# Altium project SLAVE.PrjPcb
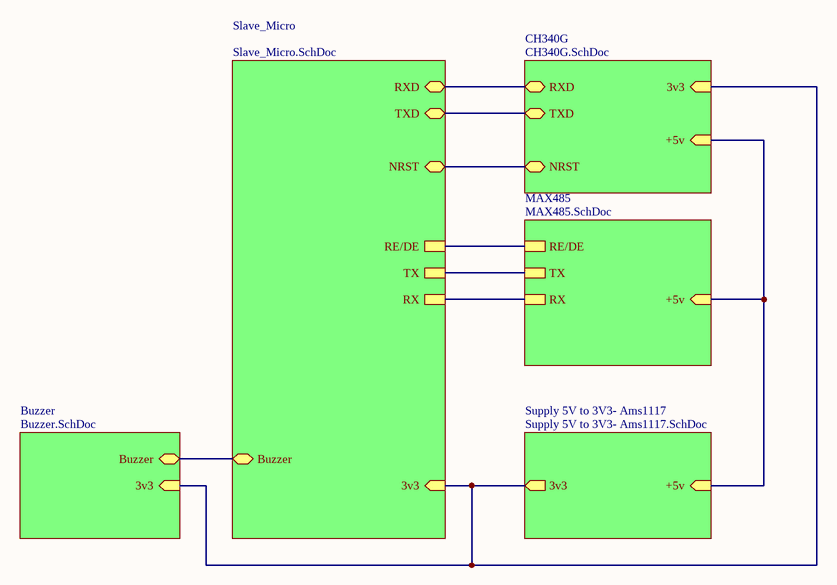
[diagram p0: SLAVE.SchDoc]
5 sheets, 56 parts. Net scope: hierarchical (ports join the sheet entries above them; power ports are global).
Board file: SLAVE.PcbDoc
Sheets:
  SLAVE.SchDoc
    Slave_Micro = Slave_Micro.SchDoc
    Supply 5V to 3V3- Ams1117 = Supply 5V to 3V3- Ams1117.SchDoc
    CH340G = CH340G.SchDoc
    MAX485 = MAX485.SchDoc

## Sheet SLAVE.SchDoc
size A

### Sub-sheets
Buzzer = Buzzer.SchDoc (file not in this document): 3v3 (in), Buzzer (bidir)
CH340G = CH340G.SchDoc: +5v (in), RXD (bidir), TXD (bidir), NRST (bidir), 3v3 (in)
MAX485 = MAX485.SchDoc: +5v (in), RE/DE, TX, RX
Slave_Micro = Slave_Micro.SchDoc: NRST (bidir), 3v3 (in), TX, RX, RE/DE, RXD (bidir), TXD (bidir), Buzzer (bidir)
Supply 5V to 3V3- Ams1117 = Supply 5V to 3V3- Ams1117.SchDoc: +5v (in), 3v3 (out)

### Nets
3v3: sheet Slave_Micro/3v3, sheet Supply 5V to 3V3- Ams1117/3v3, sheet CH340G/3v3, sheet Buzzer/3v3
NRST: sheet Slave_Micro/NRST, sheet CH340G/NRST
NetC3_2: sheet Supply 5V to 3V3- Ams1117/+5v, sheet CH340G/+5v, sheet MAX485/+5v
NetR13_2: sheet Slave_Micro/TXD, sheet CH340G/TXD
NetR65_1: sheet Slave_Micro/RX, sheet MAX485/RX
NetR66_1: sheet Slave_Micro/RE/DE, sheet MAX485/RE/DE
NetR68_1: sheet Slave_Micro/TX, sheet MAX485/TX
NetRX_2: sheet Slave_Micro/RXD, sheet CH340G/RXD
NetU1_25: sheet Slave_Micro/Buzzer, sheet Buzzer/Buzzer

## Sheet Slave_Micro.SchDoc
size A
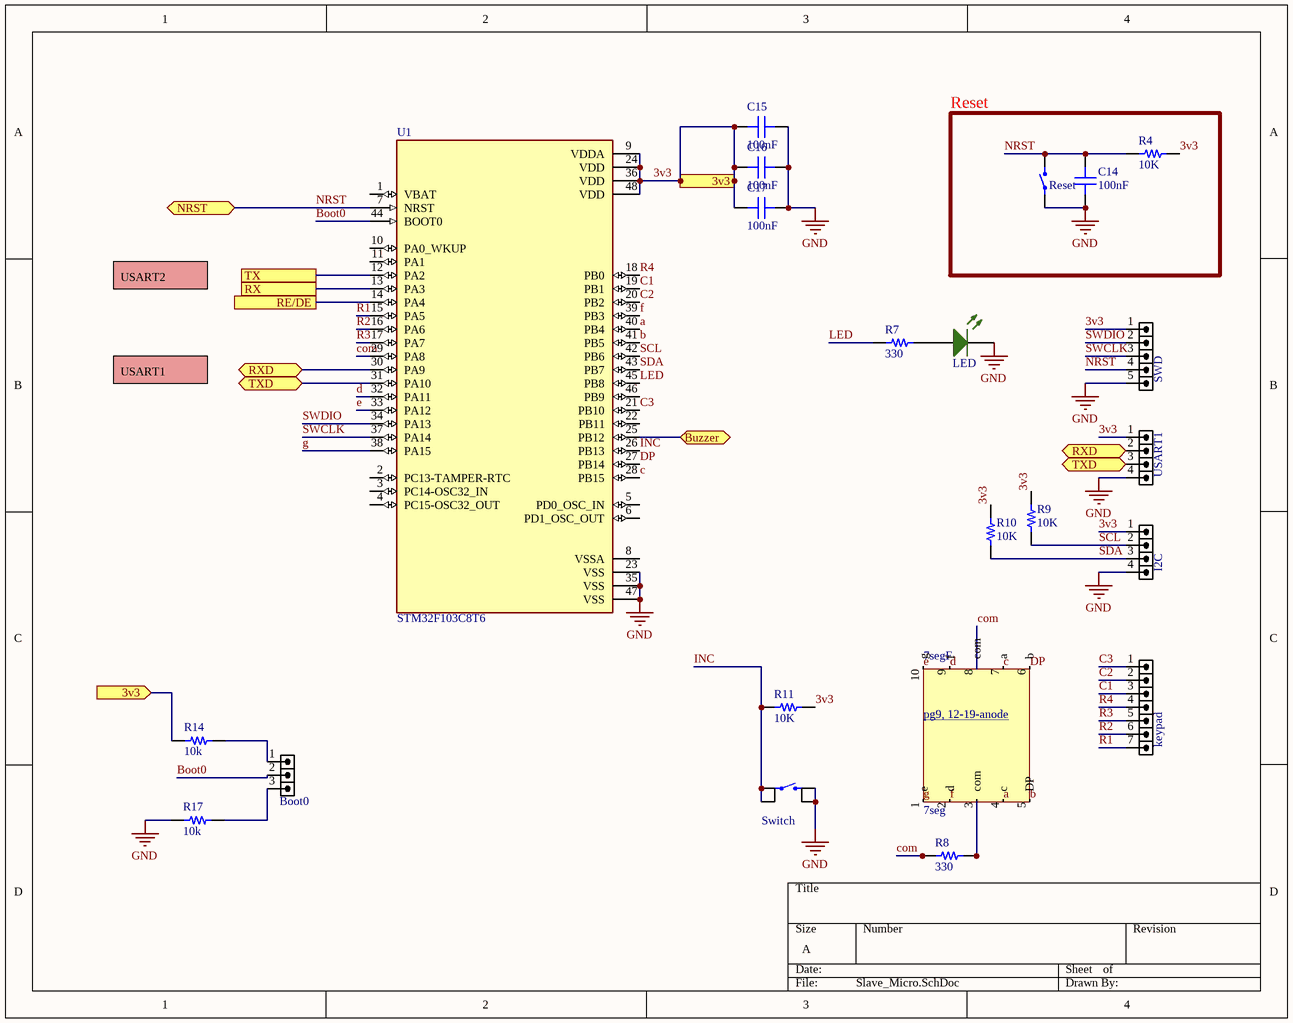
[diagram p1: Slave_Micro.SchDoc]

### Parts
7seg  7seg  [7seg 12x19]  (part F of 6)
Boot0  HDRM3  [HDR_1X3]  (value not drawn)
C14  100nF  [CAP 0805_2012]
C15  100nF  [CAP 0805_2012]
C16  100nF  [CAP 0805_2012]
C17  100nF  [CAP 0805_2012]
I2C  HDR1X4  [HDR_1X4]  (value not drawn)
keypad  HDR1X7  [HDR_1X7]  (value not drawn)
LED  LED SMD 0805 GREEN  [LED_0805_GREEN]  (value not drawn)
R4  10K  [RES 0805_2012]
R7  330  [RES 0805_2012]
R8  330  [RES 0805_2012]
R9  10K  [RES 0805_2012]
R10  10K  [RES 0805_2012]
R11  10K  [RES 0805_2012]
R14  10k  [RES 0805_2012]
R17  10k  [RES 0805_2012]
Reset  Tactile 2PIN 6X3.5mm H4.57mm (SMD)  [SWPBS_SPST_6X3X5]  (value not drawn)
SWD  HDR1X5  [HDR_1X5]  (value not drawn)
Switch  Tactile 4PIN 6X6mm H5mm (THD)  [SWPBT_SPDT_6X6X5SKHH]  (value not drawn)
U1  STM32F103C8T6  [QFP50P900X900X160-48N]
USART1  HDR1X4  [HDR_1X4]  (value not drawn)

### Blocks framed on the sheet
Reset: C14 R4 Reset

### Ports
3v3 (in), Buzzer (bidir), NRST (bidir), RE/DE, RX, RXD (bidir), TX, TXD (bidir)

### Nets
GND: C14.1 C15.1 C16.1 C17.1 I2C.4 LED.2(K) R17.1 Reset.1 SWD.5 Switch.2 Switch.3 U1.23(VSS) U1.35(VSS) U1.47(VSS) USART1.4
3v3: C15.2 C16.2 C17.2 I2C.1 R4.2 R9.2 R10.2 R11.2 R14.1 SWD.1 U1.9(VDDA) U1.24(VDD) U1.36(VDD) U1.48(VDD) USART1.1 ; port 3v3
a: 7seg.4(c) U1.40(PB4)
b: 7seg.5(DP) U1.41(PB5)
Boot0: Boot0.2 U1.44(BOOT0)
c: 7seg.7(a) U1.28(PB15)
C1: keypad.3 U1.19(PB1)
C2: keypad.2 U1.20(PB2)
C3: keypad.1 U1.21(PB10)
com: 7seg.8(com) R8.1 U1.29(PA8)
d: 7seg.9(f) U1.32(PA11)
DP: 7seg.6(b) U1.27(PB14)
e: 7seg.10(g) U1.33(PA12)
f: 7seg.2(d) U1.39(PB3)
g: 7seg.1(e) U1.38(PA15)
INC: R11.1 Switch.1 Switch.4 U1.26(PB13)
LED: R7.1 U1.45(PB8)
NRST: C14.2 R4.1 Reset.2 SWD.4 U1.7(NRST) ; port NRST
R1: keypad.7 U1.15(PA5)
R2: keypad.6 U1.16(PA6)
R3: keypad.5 U1.17(PA7)
R4: keypad.4 U1.18(PB0)
SCL: I2C.2 R9.1 U1.42(PB6)
SDA: I2C.3 R10.1 U1.43(PB7)
SWCLK: SWD.3 U1.37(PA14)
SWDIO: SWD.2 U1.34(PA13)
Net7seg_3: 7seg.3(com) R8.2
NetBoot0_1: Boot0.1 R14.2
NetBoot0_3: Boot0.3 R17.2
NetLED_1: LED.1(A) R7.2
NetR13_2: U1.31(PA10) USART1.3 ; port TXD
NetR65_1: U1.13(PA3) ; port RX
NetR66_1: U1.14(PA4) ; port RE/DE
NetR68_1: U1.12(PA2) ; port TX
NetRX_2: U1.30(PA9) USART1.2 ; port RXD
NetU1_25: U1.25(PB12) ; port Buzzer

Not connected (* = marked no-connect by the designer): U1 1(VBAT) 2(PC13-TAMPER-RTC) 3(PC14-OSC32_IN) 4(PC15-OSC32_OUT) 5(PD0_OSC_IN) 6(PD1_OSC_OUT) 8(VSSA) 10(PA0_WKUP) 11(PA1) 22(PB11) 46(PB9)

### Notes on the sheet
- USART2
- USART1
- (in symbol 7seg, part F) pg9, 12-19-anode

### Library data of the parts
7seg = 7seg: file:///C:/Users/Tamana/Downloads/7SEG-12-19mm-GREEN-ANOD.pdf
Boot0 = HDR_1X3: CONN, HEADER, Male, pitch: 2.54mm, 3POS; VALUE: HDRM3
C14-C17 = Cap 0805: SMT Capacitor; VALUE: 100nF
I2C USART1 = HDR_1X4: CONN, HEADER, Male, pitch: 2.54mm, 4POS; VALUE: HDRM4
keypad = HDR_1X7: CONN, HEADER, Male, pitch: 2.54mm, 7POS; VALUE: HDRM7
R4 R7-R11 R14 R17 = Res 0805: SMT Resistor; VALUE: 1K
Reset = Tactile 2PIN 6X3.5mm H4.57mm (SMD): Tactile Switch SPST-NO Top Actuated Surface Mount; PartNumber: FSMSMTR-ND
SWD = HDR_1X5: CONN, HEADER, Male, pitch: 2.54mm, 5POS; VALUE: HDRM5
Switch = Tactile 4PIN 6X6mm H5mm (THD): Tactile Switch SPST-NO Top Actuated Surface Mount; PartNumber: PTS645SH50SMTR92 LFS
U1 = STM32F103C8T6: ARM® Cortex®-M3 STM32F1 Microcontroller IC 32-Bit 72MHz 64KB (64K x 8) FLASH 48-LQFP (7x7); MF: STMicroelectronics; SnapEDA_Link: https://www.snapeda.com/parts/STM32F103C8T6/STMicroelectronics/view-part/?ref=snap; Package: LQFP-48 STMicroelectronics; Value: *; MP: STM32F103C8T6; Check_prices: https://www.snapeda.com/parts/STM32F103C8T6/STMicroelectronics/view-part/?ref=eda

## Sheet Supply 5V to 3V3- Ams1117.SchDoc
size A
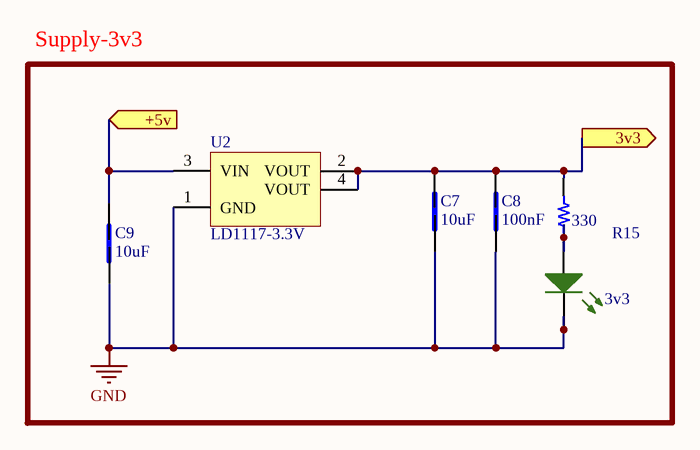
[diagram p2: Supply 5V to 3V3- Ams1117.SchDoc]

### Parts
3v3  LED SMD 0805 GREEN  [LED_0805_GREEN]  (value not drawn)
C7  10uF  [CAP 0805_2012]
C8  100nF  [CAP 0805_2012]
C9  10uF  [CAP 0805_2012]
R15  330  [RES 0805_2012]
U2  LD1117-3.3V  [SOT-223-4 6.5X7MM P2.3MM]

### Blocks framed on the sheet
Supply-3v3: 3v3 C7-C9 R15 U2

### Ports
3v3 (out), +5v (in)

### Nets
GND: 3v3.2(K) C7.1 C8.1 C9.1 U2.1(GND)
3v3: C7.2 C8.2 R15.1 U2.2(VOUT) U2.4(VOUT) ; port 3v3
Net3v3_1: 3v3.1(A) R15.2
NetC3_2: C9.2 U2.3(VIN) ; port +5v

### Library data of the parts
C7-C9 = LD051C182KAB2A: COMMERCIAL CHIP STD JAPAN BULK - FN TAPE/REEL, 7 INCH PAPER TAPE-0805; Package: None; Price: None; Value: *; MP: LD051C182KAB2A; Availability: Unavailable
R15 = Res 0805: SMT Resistor; VALUE: 1K
U2 = LD1117-3.3V (SMD SOT-223): Linear Voltage Regulator IC  1 Output  800mA SOT-223; PartNumber: LD1117S33CTR

## Sheet CH340G.SchDoc
size A
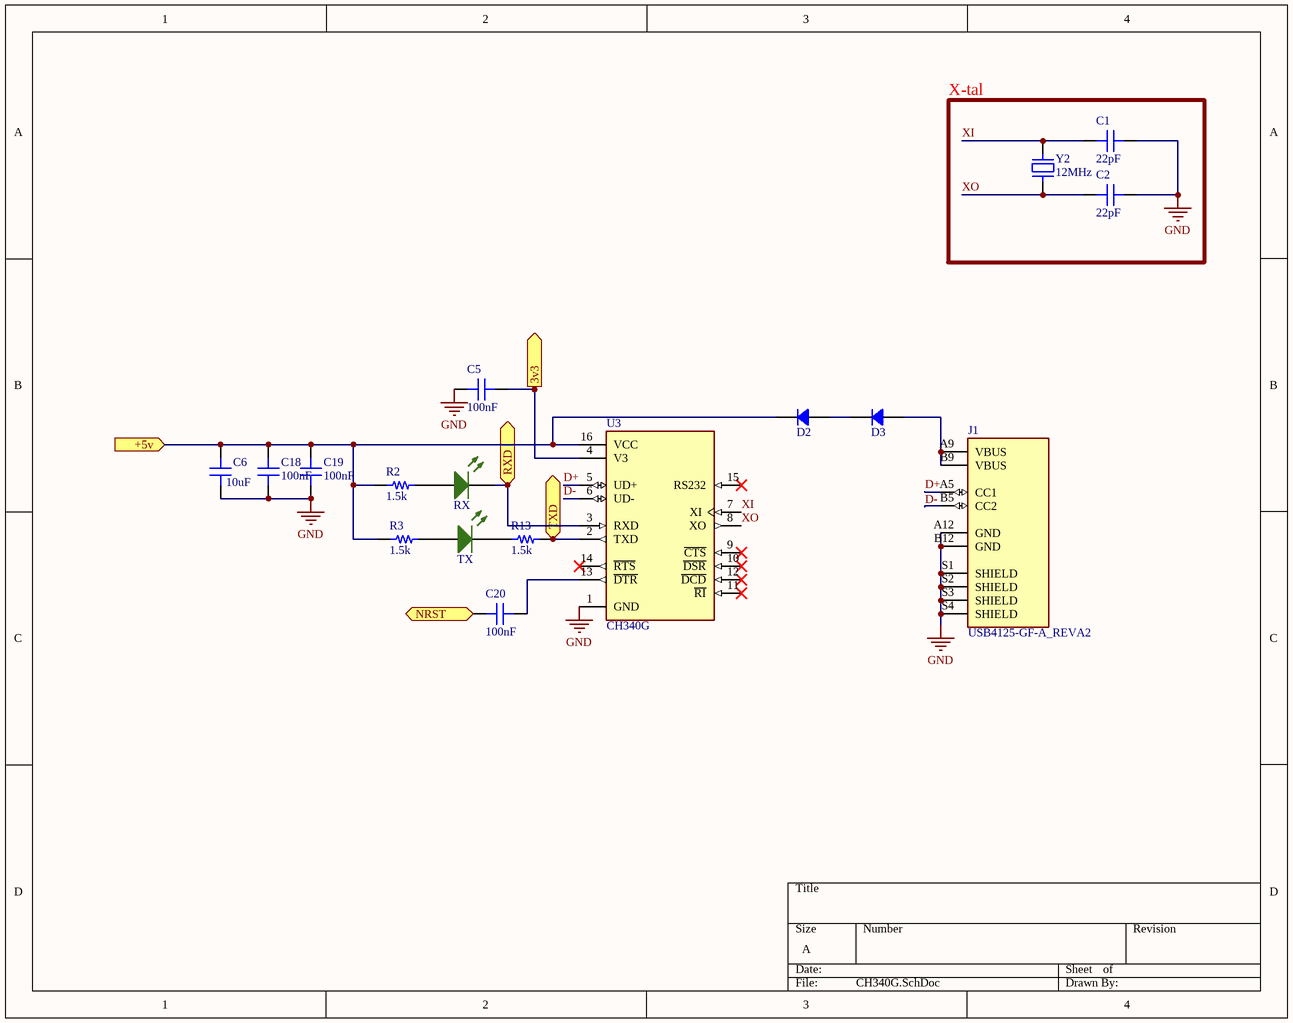
[diagram p3: CH340G.SchDoc]

### Parts
C1  22pF  [CAP 0805_2012]
C2  22pF  [CAP 0805_2012]
C5  100nF  [CAP 0805_2012]
C6  10uF  [CAP 0805_2012]
C18  100nF  [CAP 0805_2012]
C19  100nF  [CAP 0805_2012]
C20  100nF  [CAP 0805_2012]
D2  1N4148  [SOD-523F]  (value not drawn)
D3  1N4148  [SOD-523F]  (value not drawn)
J1  USB4125-GF-A_REVA2  [GCT_USB4125-GF-A_REVA2]
R2  1.5k  [RES 0805_2012]
R3  1.5k  [RES 0805_2012]
R13  1.5k  [RES 0805_2012]
RX  LED SMD 0805 GREEN  [LED_0805_GREEN]  (value not drawn)
TX  LED SMD 0805 GREEN  [LED_0805_GREEN]  (value not drawn)
U3  CH340G  [SOIC127P600X180-16N]
Y2  12MHz  [HC-49S SMD]

### Blocks framed on the sheet
X-tal: C1 C2 Y2

### Ports
3v3 (out), +5v (in), NRST (bidir), RXD (bidir), TXD (bidir)

### Nets
GND: C1.2 C2.2 C5.1 C6.1 C18.1 C19.1 J1.A12(GND) J1.B12(GND) J1.S1(SHIELD) J1.S2(SHIELD) J1.S3(SHIELD) J1.S4(SHIELD) U3.1(GND)
3v3: C5.2 U3.4(V3) ; port 3v3
D+: J1.A5(CC1) U3.5(UD+)
D-: J1.B5(CC2) U3.6(UD-)
NRST: C20.1 ; port NRST
XI: C1.1 U3.7(XI) Y2.2
XO: C2.1 U3.8(XO) Y2.1
NetC3_2: C6.2 C18.2 C19.2 D2.2 R2.1 R3.1 U3.16(VCC) ; port +5v
NetC20_2: C20.2 U3.13(~{DTR})
NetD2_1: D2.1 D3.2
NetD3_1: D3.1 J1.A9(VBUS) J1.B9(VBUS)
NetR2_2: R2.2 RX.1(A)
NetR3_2: R3.2 TX.1(A)
NetR13_1: R13.1 TX.2(K)
NetR13_2: R13.2 U3.2(TXD) ; port TXD
NetRX_2: RX.2(K) U3.3(RXD) ; port RXD

Not connected (* = marked no-connect by the designer): U3 9(~{CTS})* 10(~{DSR})* 11(~{RI})* 12(~{DCD})* 14(~{RTS})* 15(RS232)*

### Library data of the parts
C1 C2 C6 = Cap 0805: SMT Capacitor; VALUE: 100nF
C5 C18-C20 = Cap 0805: SMT Capacitor; VALUE: 100nF
D2 D3 = 1N4148 (SMD): Diode Standard 75V 200mA Surface Mount SOD-523F; PartNumber: 1N4148WT
R2 R3 R13 = Res 0805: SMT Resistor; VALUE: 1K
U3 = CH340G: USB Interface Integrated Circuit; MF: WCH; Value: *; SnapEDA_Link: https://www.snapeda.com/parts/Ch340G/WCH/view-part/?ref=snap; MP: Ch340G; Check_prices: https://www.snapeda.com/parts/Ch340G/WCH/view-part/?ref=eda; Availability: Not in stock; Price: None; Package: None
Y2 = Crystal HC-49S SMD 8MHz: SMT Crystal; PartNumber: ABLS-8.000MHZ-K4T
J1 = USB4125-GF-A_REVA2: Package: None; Availability: Unavailable; MP: USB4125-GF-A_REVA2; Value: *; Price: None

## Sheet MAX485.SchDoc
size A
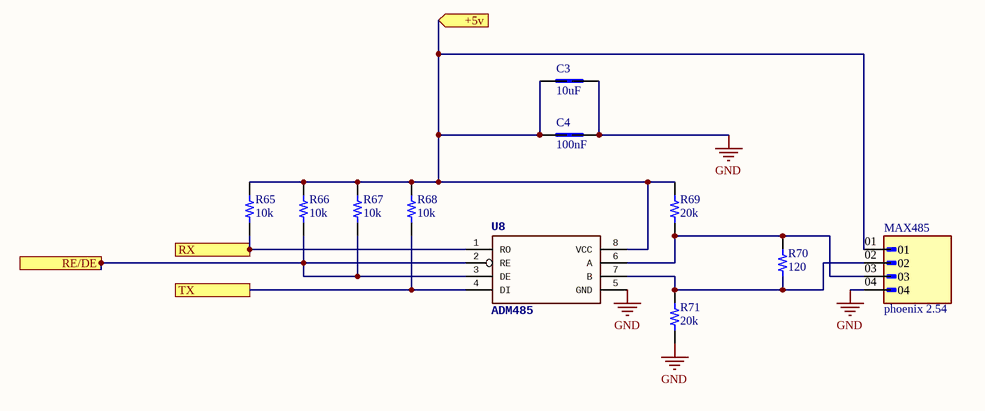
[diagram p4: MAX485.SchDoc]

### Parts
C3  10uF  [CAP 0805_2012]
C4  100nF  [CAP 0805_2012]
MAX485  phoenix 2.54  [PHOENIX_1881574]
R65  10k  [RES 0805_2012]
R66  10k  [RES 0805_2012]
R67  10k  [RES 0805_2012]
R68  10k  [RES 0805_2012]
R69  20k  [RES 0805_2012]
R70  120  [RES 0805_2012]
R71  20k  [RES 0805_2012]
U8  ADM485  [SOIC-8 4.9X3.9MM P1.27MM]

### Ports
+5v (in), RE/DE, RX, TX

### Nets
GND: C3.1 C4.1 MAX485.04 R71.1 U8.5(GND)
NetC3_2: C3.2 C4.2 MAX485.01 R65.2 R66.2 R67.2 R68.2 R69.2 U8.8(VCC) ; port +5v
NetMAX485_02: MAX485.02 R70.1 R71.2 U8.7(B)
NetMAX485_03: MAX485.03 R69.1 R70.2 U8.6(A)
NetR65_1: R65.1 U8.1(RO) ; port RX
NetR66_1: R66.1 R67.1 U8.2(RE) U8.3(DE) ; port RE/DE
NetR68_1: R68.1 U8.4(DI) ; port TX

### Library data of the parts
C3 C4 = LD051C182KAB2A: as C7 on sheet Supply 5V to 3V3- Ams1117; Package: None; Price: None; Value: *; MP: LD051C182KAB2A; Availability: Unavailable
MAX485 = 1881574: MF: {'manufacturer': u'Phoenix Contact'}; Package: None; Price: None; Value: *; MP: 1881574; Availability: Unavailable
R65-R71 = Res 0805: SMT Resistor; VALUE: 1K
U8 = ADM485 (SMD): RS485 Interface; PartNumber: ADM4853ARZ-REEL7

## Nets that join several sheets
GND: Slave_Micro (15 pins), Supply 5V to 3V3- Ams1117 (5 pins), CH340G (13 pins), MAX485 (5 pins)
3v3: Slave_Micro (15 pins), Supply 5V to 3V3- Ams1117 (5 pins), CH340G (C5.2 U3.4)
NetC3_2: Supply 5V to 3V3- Ams1117 (C9.2 U2.3), CH340G (7 pins), MAX485 (9 pins)
NetR13_2: Slave_Micro (U1.31 USART1.3), CH340G (R13.2 U3.2)
NetR65_1: Slave_Micro (U1.13), MAX485 (R65.1 U8.1)
NetR66_1: Slave_Micro (U1.14), MAX485 (R66.1 R67.1 U8.2 U8.3)
NetR68_1: Slave_Micro (U1.12), MAX485 (R68.1 U8.4)
NetRX_2: Slave_Micro (U1.30 USART1.2), CH340G (RX.2 U3.3)
NRST: Slave_Micro (5 pins), CH340G (C20.1)